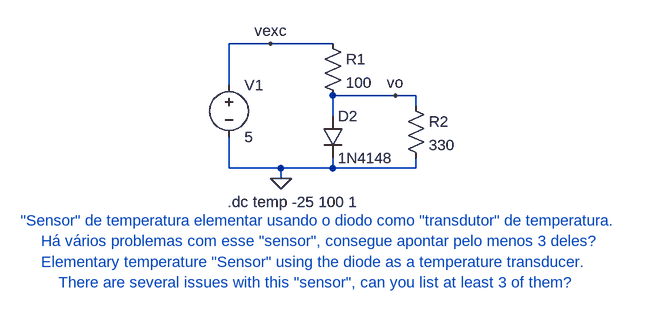
[diagram p0: schematic rudimentary_diode-based_temp_sensor_v1.asc]
rudimentary_diode-based_temp_sensor_v1.asc, the LTspice schematic file:
Version 4
SHEET 1 964 680
WIRE 160 32 96 32
WIRE 256 32 160 32
WIRE 96 96 96 32
WIRE 352 112 256 112
WIRE 384 112 352 112
WIRE 384 128 384 112
WIRE 256 144 256 112
WIRE 96 224 96 176
WIRE 176 224 96 224
WIRE 256 224 256 208
WIRE 256 224 176 224
WIRE 384 224 384 208
WIRE 384 224 256 224
WIRE 176 240 176 224
FLAG 160 32 vexc
FLAG 352 112 vo
FLAG 176 240 0
SYMBOL voltage 96 80 R0
WINDOW 123 0 0 Left 0
WINDOW 39 0 0 Left 0
SYMATTR InstName V1
SYMATTR Value 5
SYMBOL res 240 16 R0
SYMATTR InstName R1
SYMATTR Value 100
SYMBOL diode 240 144 R0
SYMATTR InstName D2
SYMATTR Value 1N4148
SYMBOL res 368 112 R0
SYMATTR InstName R2
SYMATTR Value 330
TEXT 94 276 Left 2 !.dc temp -25 100 1
TEXT 240 320 Center 2 ;"Sensor" de temperatura elementar usando o diodo como "transdutor" de temperatura.\nHá vários problemas com esse "sensor", consegue apontar pelo menos 3 deles?
TEXT 232 384 Center 2 ;Elementary temperature "Sensor" using the diode as a temperature transducer.\nThere are several issues with this "sensor", can you list at least 3 of them?

The netlist it stands for:
* rudimentary_diode-based_temp_sensor_v1.asc
V1 vexc 0 5
R1 vexc vo 100
D2 vo 0 1N4148
R2 vo 0 330
.model D D
.lib standard.dio
.dc temp -25 100 1
* "Sensor" de temperatura elementar usando o diodo como "transdutor" de temperatura.
* Há vários problemas com esse "sensor", consegue apontar pelo menos 3 deles?
* Elementary temperature "Sensor" using the diode as a temperature transducer.
* There are several issues with this "sensor", can you list at least 3 of them?
.backanno
.end